# EAGLE design Wifi Schemati (EAGLE 9.2.2)
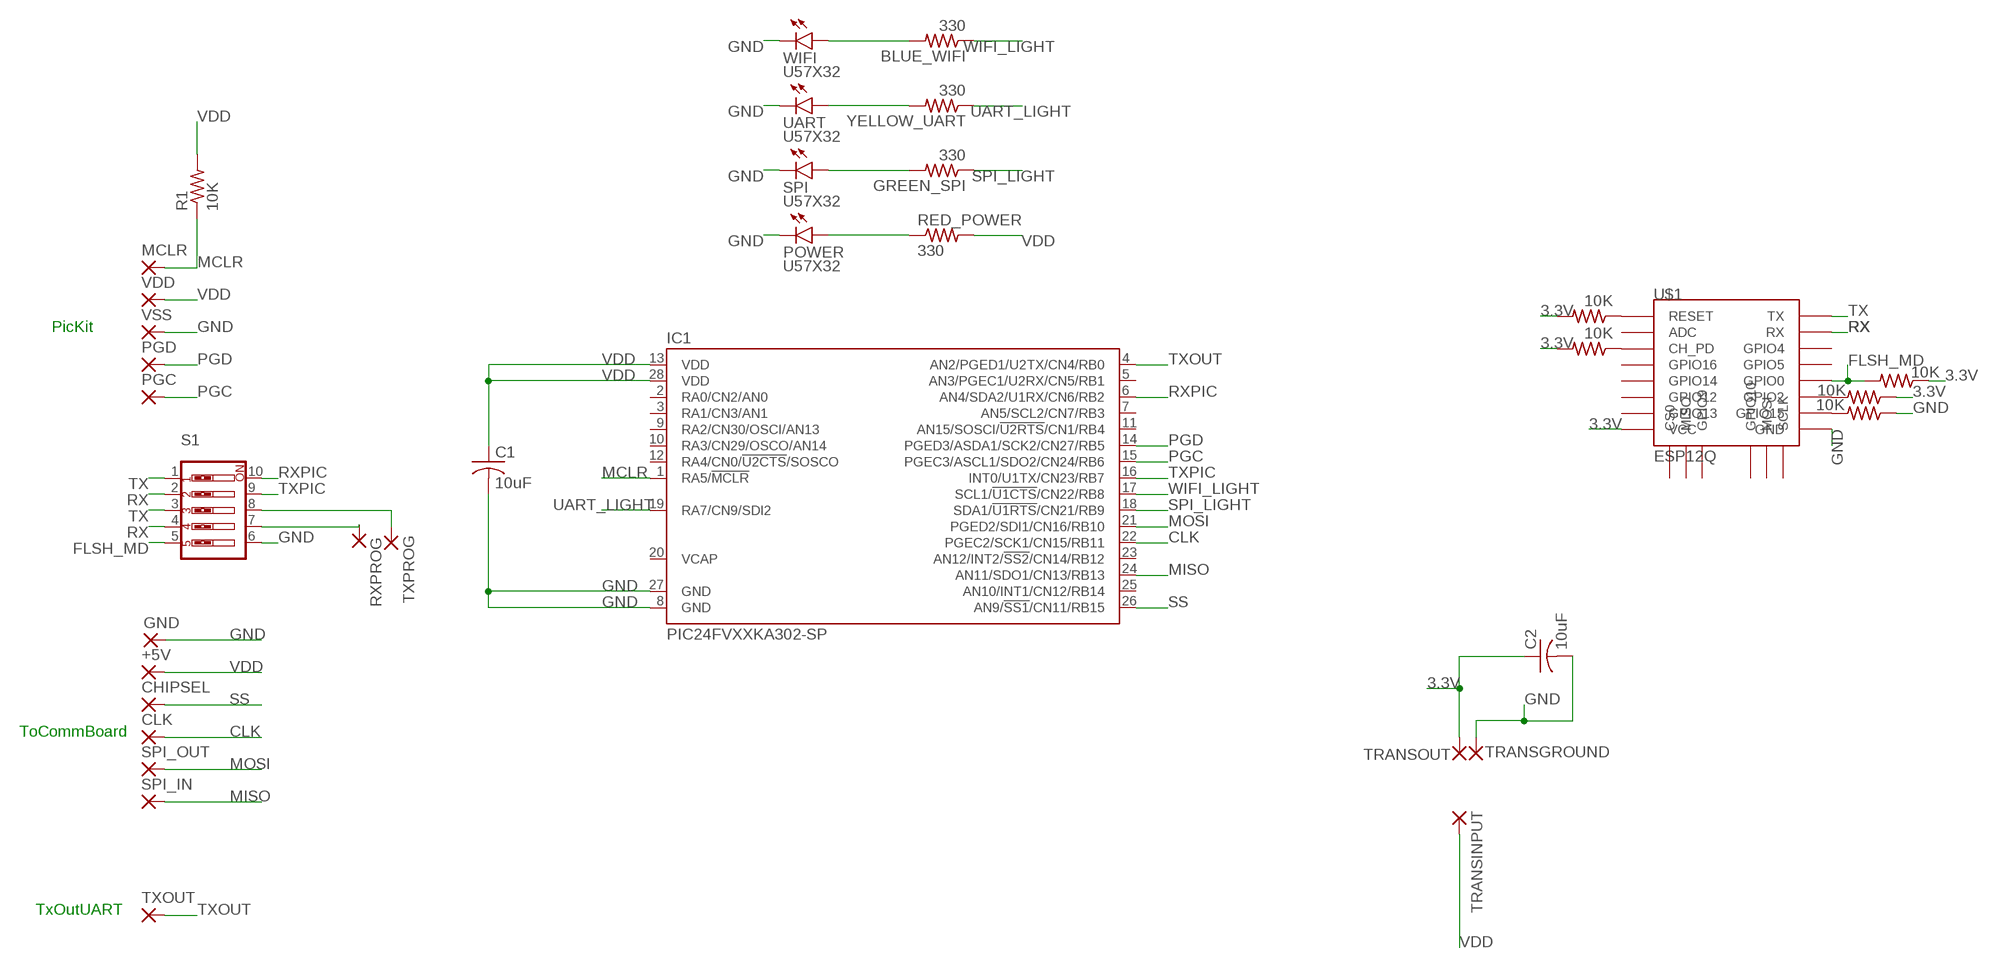
[diagram p0: schematic, sheet 1]

## Parts
+5V  1,6/0,8  [1,6/0,8]
BLUE_WIFI  330  R-US_0207/7  [0207/7]
C1  10uF  C-US025-025X050  [C025-025X050]
C2  10uF  C-US025-025X050  [C025-025X050]
CHIPSEL  1,6/0,8  [1,6/0,8]
CLK  1,6/0,8  [1,6/0,8]
GND  1,6/0,8  [1,6/0,8]
GREEN_SPI  330  R-US_0207/7  [0207/7]
IC1  PIC24FVXXKA302-SP  [DIL28-3]
MCLR  1,6/0,8  [1,6/0,8]
PGC  1,6/0,8  [1,6/0,8]
PGD  1,6/0,8  [1,6/0,8]
POWER  U57X32  [U57X32]
R1  10K  R-US_0207/7  [0207/7]
R2  10K  R-US_0207/7  [0207/7]
R3  10K  R-US_0207/7  [0207/7]
R4  10K  R-US_0207/7  [0207/7]
R5  10K  R-US_0207/7  [0207/7]
R6  10K  R-US_0207/7  [0207/7]
RED_POWER  330  R-US_0207/7  [0207/7]
RXPROG  1,6/0,8  [1,6/0,8]
S1  SW_DIP-5  [EDG-05]
SPI  U57X32  [U57X32]
SPI_IN  1,6/0,8  [1,6/0,8]
SPI_OUT  1,6/0,8  [1,6/0,8]
TRANSGROUND  1,6/0,8  [1,6/0,8]
TRANSINPUT  1,6/0,8  [1,6/0,8]
TRANSOUT  1,6/0,8  [1,6/0,8]
TXOUT  1,6/0,8  [1,6/0,8]
TXPROG  1,6/0,8  [1,6/0,8]
U$1  ESP12Q  [ESP12Q]
UART  U57X32  [U57X32]
VDD  1,6/0,8  [1,6/0,8]
VSS  1,6/0,8  [1,6/0,8]
WIFI  U57X32  [U57X32]
YELLOW_UART  330  R-US_0207/7  [0207/7]

## Nets
3.3V: C2.1 R3.1 R4.1 R5.2 R6.2 TRANSOUT.1(P) U$1.VCC
CLK: CLK.1(P) IC1.22(PGEC2/SCK1/CN15/RB11)
FLSH_MD: R4.2 S1.5 U$1.GPIO0
GND: C1.2 C2.2 GND.1(P) IC1.8(GND) IC1.27(GND) POWER.K(C) R2.1 S1.6 SPI.K(C) TRANSGROUND.1(P) U$1.GND UART.K(C) VSS.1(P) WIFI.K(C)
MCLR: IC1.1(RA5/!MCLR) MCLR.1(P) R1.1
MISO: IC1.24(AN11/SDO1/CN13/RB13) SPI_IN.1(P)
MOSI: IC1.21(PGED2/SDI1/CN16/RB10) SPI_OUT.1(P)
N$1: R5.1 U$1.RESET
N$2: R2.2 U$1.GPIO15
N$3: R3.2 U$1.GPIO2
N$4: S1.8 TXPROG.1(P)
N$5: RXPROG.1(P) S1.7
N$6: R6.1 U$1.CH_PD
N$7: POWER.A RED_POWER.1
N$8: GREEN_SPI.2 SPI.A
N$10: UART.A YELLOW_UART.2
N$11: BLUE_WIFI.2 WIFI.A
PGC: IC1.15(PGEC3/ASCL1/SDO2/CN24/RB6) PGC.1(P)
PGD: IC1.14(PGED3/ASDA1/SCK2/CN27/RB5) PGD.1(P)
RX: S1.2 S1.4 U$1.RX
RXPIC: IC1.6(AN4/SDA2/U1RX/CN6/RB2) S1.10
SPI_LIGHT: GREEN_SPI.1 IC1.18(SDA1/!U1RTS!/CN21/RB9)
SS: CHIPSEL.1(P) IC1.26(AN9/!SS1!/CN11/RB15)
TX: S1.1 S1.3 U$1.TX
TXOUT: IC1.4(AN2/PGED1/U2TX/CN4/RB0) TXOUT.1(P)
TXPIC: IC1.16(INT0/U1TX/CN23/RB7) S1.9
UART_LIGHT: IC1.19(RA7/CN9/SDI2) YELLOW_UART.1
VDD: +5V.1(P) C1.1 IC1.13(VDD) IC1.28(VDD) R1.2 RED_POWER.2 TRANSINPUT.1(P) VDD.1(P)
WIFI_LIGHT: BLUE_WIFI.1 IC1.17(SCL1/!U1CTS!/CN22/RB8)
Unconnected: IC1.2(RA0/CN2/AN0) IC1.3(RA1/CN3/AN1) IC1.5(AN3/PGEC1/U2RX/CN5/RB1) IC1.7(AN5/SCL2/CN7/RB3) IC1.9(RA2/CN30/OSCI/AN13) IC1.10(RA3/CN29/OSCO/AN14) IC1.11(AN15/SOSCI/!U2RTS!/CN1/RB4) IC1.12(RA4/CN0/!U2CTS!/SOSCO) IC1.20(VCAP) IC1.23(AN12/INT2/!SS2!/CN14/RB12) IC1.25(AN10/INT1/CN12/RB14) U$1.ADC U$1.CS0 U$1.GPIO4 U$1.GPIO5 U$1.GPIO9 U$1.GPIO10 U$1.GPIO12 U$1.GPIO13 U$1.GPIO14 U$1.GPIO16 U$1.MISO U$1.MOSI U$1.SCLK

## Notes on the sheet
- PicKit
- ToCommBoard
- TxOutUART

## Library data of the parts
+5V CHIPSEL CLK GND MCLR PGC PGD RXPROG SPI_IN SPI_OUT TRANSGROUND TRANSINPUT TRANSOUT TXOUT TXPROG VDD VSS = wirepad:1,6/0,8: THROUGH-HOLE PAD
BLUE_WIFI GREEN_SPI R1-R6 RED_POWER YELLOW_UART = rcl:R-US_: RESISTOR, American symbol; SPICEPREFIX: R
C1 C2 = rcl:C-US: CAPACITOR, American symbol; SPICEPREFIX: C
IC1 = pic24kakl:PIC24FVXXKA302: PIC24FVXXKA302 2.0-5.5V 28 pin
POWER SPI UART WIFI = led:U57X32: LED rectangle, 5.7 x 3.2 mm
S1 = special:SW_DIP-5: DIP SWITCH
U$1 = esp826612q:ESP12Q: ESP8266 Wifi module 12-Q; SPICEPREFIX: X

## Board
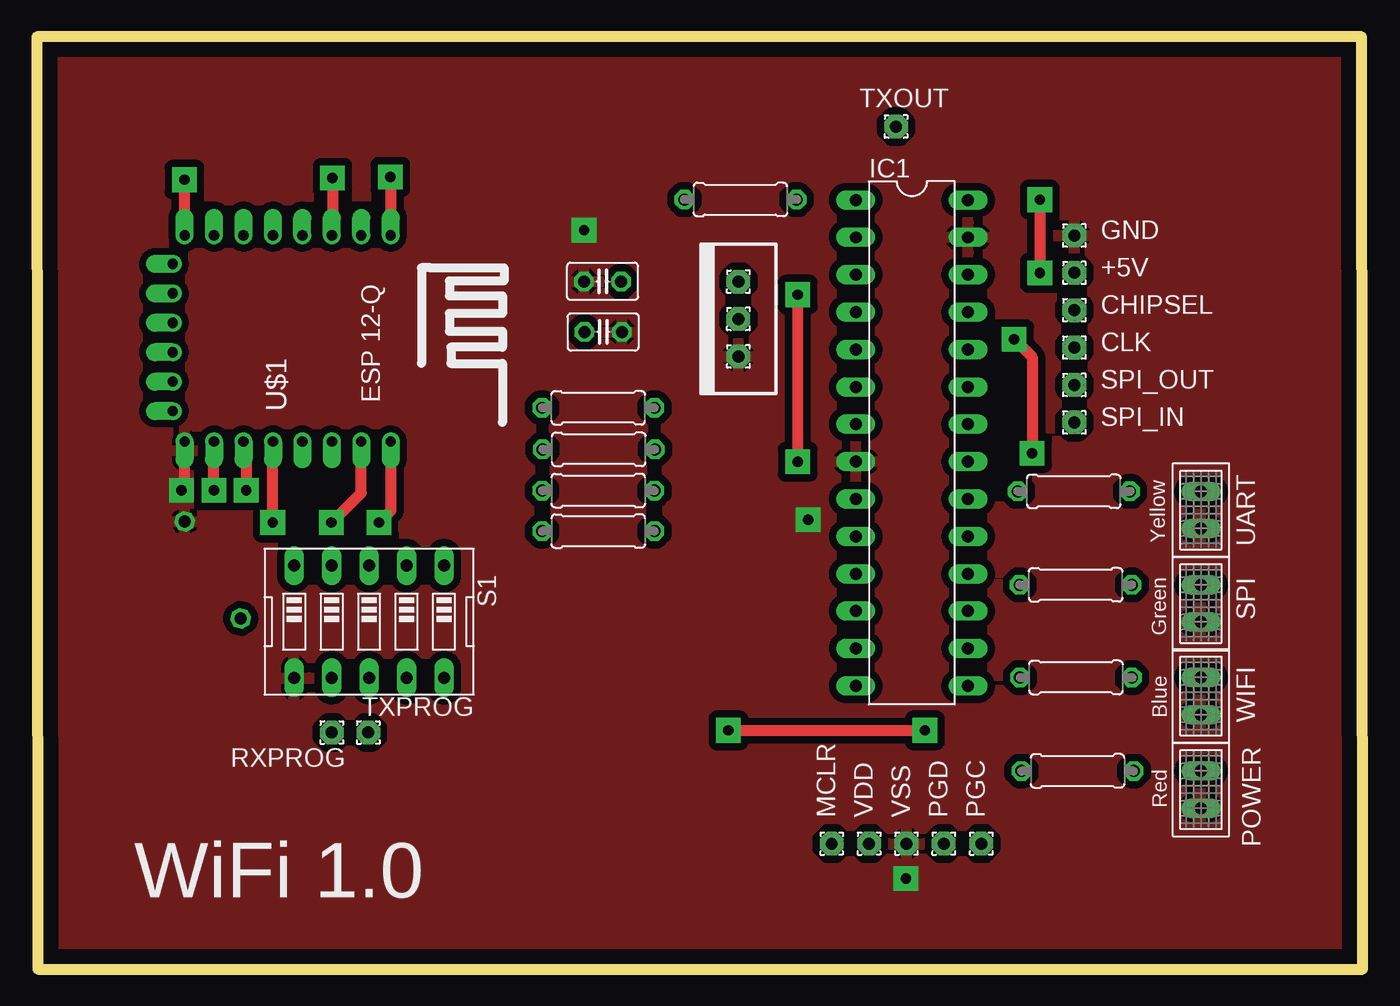
[diagram p1: board, top side]
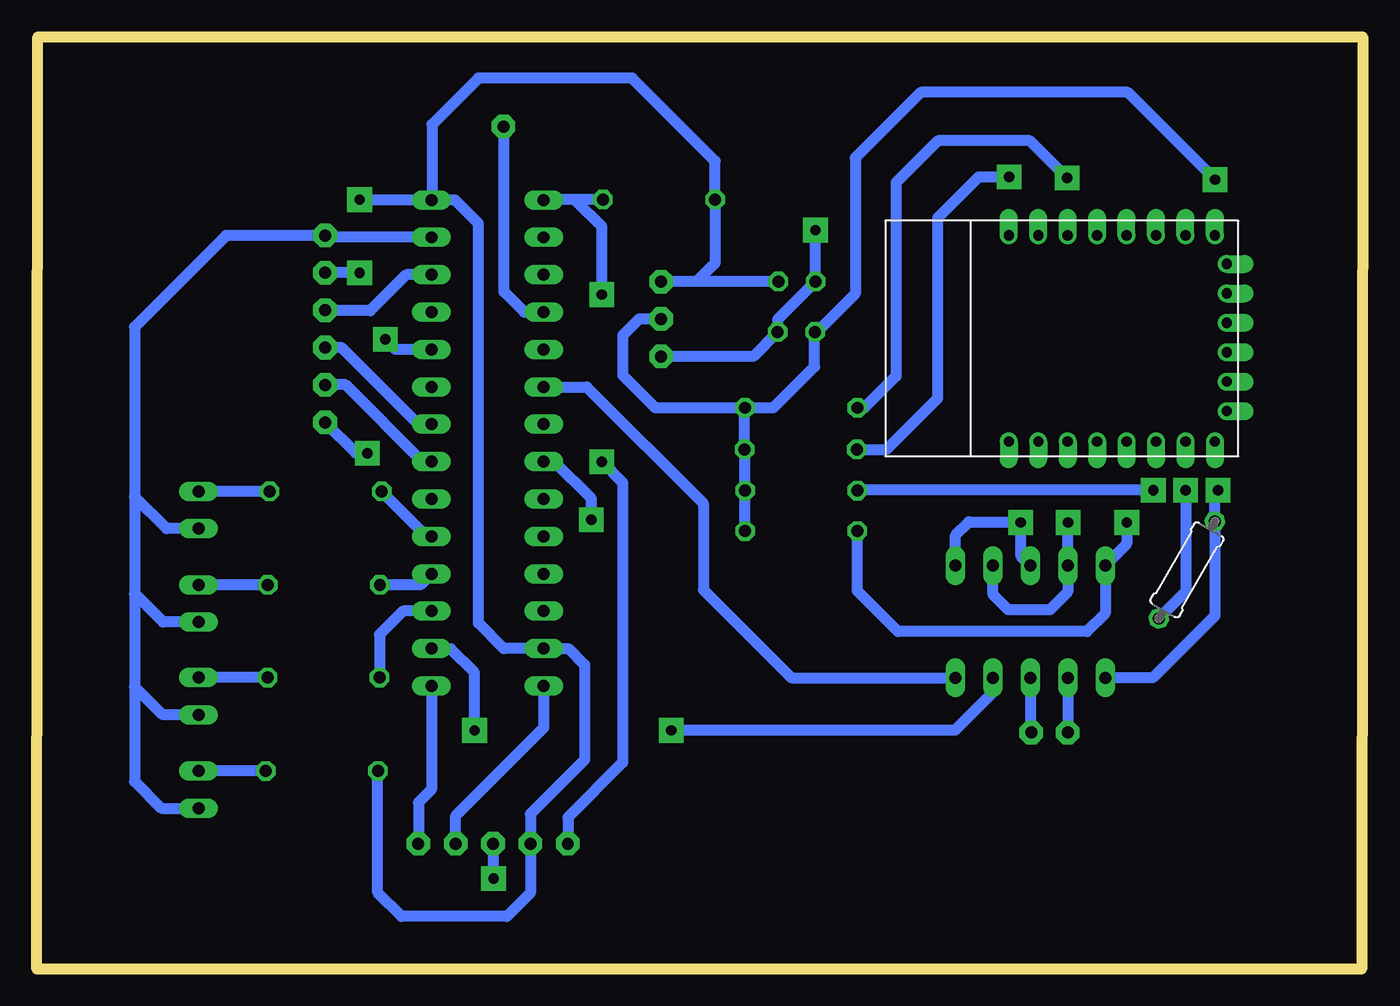
[diagram p2: board, bottom side, seen from below]

Size 90.1 x 63.36 mm. Coordinates in mm from the lower left corner, seen from the top.
Outline: 0.06,0 90.1,0 90.03,63.36 0,63.36 0.06,0
Copper layers (1*16): Top 0.035mm / dielectric 1.5mm / Bottom 0.035mm
Design rules "default *": minimum track width 10mil, minimum drill 22mm, track to track 20mil, track to pad 20mil, pad to pad 20mil, via to via 20mil, smd to smd 8mil, copper to edge 40mil, drill to drill 8mil, minimum pad ring 10mil, minimum via ring 8mil, stop-mask expansion 4mil, vias tented up to drill 0mil, thermal gap 10mil

### Footprints (pad centres in the part's own frame; a part is rotated, then mirrored left to right if it is on the bottom)
1,6/0,8 = drill 0.813 pad 1.6 octagon: 1 0,0
0207/7 = drill 0.813 octagon: 1 -3.81,0; 2 3.81,0
C025-025X050 = drill 0.813 octagon: 1 -1.27,0; 2 1.27,0
DIL28-3 = drill 0.813 long: 1 -16.51,-3.81; 2 -13.97,-3.81; 3 -11.43,-3.81; 4 -8.89,-3.81; 5 -6.35,-3.81; 6 -3.81,-3.81; 7 -1.27,-3.81; 8 1.27,-3.81; 9 3.81,-3.81; 10 6.35,-3.81; 11 8.89,-3.81; 12 11.43,-3.81; 13 13.97,-3.81; 14 16.51,-3.81; 15 16.51,3.81; 16 13.97,3.81; 17 11.43,3.81; 18 8.89,3.81; 19 6.35,3.81; 20 3.81,3.81; 21 1.27,3.81; 22 -1.27,3.81; 23 -3.81,3.81; 24 -6.35,3.81; 25 -8.89,3.81; 26 -11.43,3.81; 27 -13.97,3.81; 28 -16.51,3.81
U57X32 = drill 0.813 long: A -1.27,0; K 1.27,0
EDG-05 = drill 0.813 long: 1 -5.08,-3.81; 2 -2.54,-3.81; 3 0,-3.81; 4 2.54,-3.81; 5 5.08,-3.81; 6 5.08,3.81; 7 2.54,3.81; 8 0,3.81; 9 -2.54,3.81; 10 -5.08,3.81
ESP12Q = drill 0.7 offset: ADC -7.1,3.8; CH_PD -7.1,1.8; CS0 -5.165,-9.005; GND 6.9,-8.2; GPIO0 6.9,-2.2; GPIO2 6.9,-4.2; GPIO4 6.9,1.8; GPIO5 6.9,-0.2; GPIO9 -1.165,-9.005; GPIO10 0.835,-9.005; GPIO12 -7.1,-4.2; GPIO13 -7.1,-6.2; GPIO14 -7.1,-2.2; GPIO15 6.9,-6.2; GPIO16 -7.1,-0.2; MISO -3.165,-9.005; MOSI 2.835,-9.005; RESET -7.1,5.8; RX 6.9,3.8; SCLK 4.835,-9.005; TX 6.9,5.8; VCC -7.1,-8.2

### Placement (x,y rotation side)
+5V  70.5,47.32 0 top
BLUE_WIFI  70.61,19.82 0 top
C1  38.44,46.74 180 top
C2  38.48,43.3 0 top
CHIPSEL  70.5,44.78 0 top
CLK  70.5,42.24 0 top
GND  70.5,49.86 0 top
GREEN_SPI  70.6,26.12 0 top
IC1  59.46,35.76 270 top
MCLR  54.01,8.53 90 top
PGC  64.17,8.53 90 top
PGD  61.63,8.53 90 top
POWER  79.1,12.2 270 top
R1  47.81,52.3 180 top
R2  11.95,27.13 240 bottom
R3  38.15,32.52 180 top
R4  38.15,29.76 180 top
R5  38.19,35.33 0 top
R6  38.15,38.15 0 top
RED_POWER  70.72,13.47 180 top
RXPROG  20.05,16.07 90 top
S1  22.58,23.61 180 top
SPI  79.1,24.85 270 top
SPI_IN  70.5,37.16 0 top
SPI_OUT  70.5,39.7 0 top
TRANSGROUND  47.67,41.64 0 top
TRANSINPUT  47.67,46.72 0 top
TRANSOUT  47.67,44.18 0 top
TXOUT  58.38,57.26 0 top
TXPROG  22.52,16.07 90 top
U$1  18.24,42.76 270 top
UART  79.1,31.2 270 top
VDD  56.55,8.53 90 top
VSS  59.09,8.53 90 top
WIFI  79.1,18.55 270 top
YELLOW_UART  70.47,32.47 0 top

### Tracks (layer width: path | path; a pad name or v marks a point on that pad's centre or on a via)
3.3V  (via drill 0.7 pad 1.68)
  Top 0.762: v10.03,53.64 10.03,49.88 U$1.VCC
  Bottom 0.762: R4.1 R3.1 41.96,35.29 R5.2 42,38.11 R6.2 | R6.2 40.04,38.15 37.25,40.94 37.25,43.26 | 37.25,43.26 C2.1 | R6.2 48.08,38.15 50.29,40.35 50.29,43.06 49.17,44.18 TRANSOUT.1 | v10.03,53.64 15.96,59.58 30.03,59.58 34.48,55.13 34.48,45.9 37.12,43.26 37.25,43.26
CLK
  Bottom 0.762: IC1.22 64.19,37.03 69.38,42.23 70.49,42.23 CLK.1
FLSH_MD  (via drill 0.7 pad 1.68)
  Top 0.762: v16.03,30.35 16.03,35.84 U$1.GPIO0
  Bottom 0.762: R4.2 34.35,25.71 31.58,22.94 18.74,22.94 17.5,24.17 S1.5 16.03,28.89 v16.03,30.35
GND  (via drill 0.7 pad 1.68)
  Top 0.762: v9.83,32.55 10.04,32.76 U$1.GND
  Bottom 0.762: TRANSGROUND.1 41.41,41.64 C2.2 39.75,44.16 C1.2 37.17,50.21 v37.19,50.23 | POWER.K 81.63,10.93 83.45,12.74 83.45,19.19 | 83.45,32.1 83.45,43.64 77.23,49.86 GND.1 70.37,49.73 IC1.27 | 83.45,32.1 83.45,25.52 | 83.45,25.52 83.45,19.19 | WIFI.K 81.53,17.28 83.45,19.19 | SPI.K 81.51,23.58 83.45,25.52 | UART.K 81.28,29.93 83.45,32.1 | VSS.1 59.09,6.2 v59.06,6.16 | S1.6 14.26,19.8 10.04,24.02 R2.1 10.04,32.34 v9.83,32.55 | v52.41,30.55 52.41,31.97 54.94,34.49 IC1.8
  pour Top: 0.09,63.19 89.9,63.19 89.9,0.1 0.09,0.1
MCLR  (via drill 0.7 pad 1.68)
  Top 0.762: v51.7,45.84 v51.7,34.48
  Bottom 0.762: MCLR.1 54.01,10.3 50.29,14.03 50.29,33.06 v51.7,34.48 | v51.7,45.84 51.7,50.46 53.45,52.2 53.45,52.3 | R1.1 53.45,52.3 | 53.45,52.3 55.65,52.3 IC1.1
MISO  (via drill 0.7 pad 1.68)
  Top 0.762: v67.64,35.06 67.64,41.58 v66.41,42.81
  Bottom 0.762: v67.64,35.06 68.41,35.06 SPI_IN.1 | IC1.24 65.72,42.11 v66.41,42.81
MOSI
  Bottom 0.762: IC1.21 63.9,34.49 69.12,39.71 70.49,39.71 SPI_OUT.1
N$1  (via drill 0.7 pad 1.68)
  Top 0.762: v24.03,53.84 24.03,49.88 U$1.RESET
  Bottom 0.762: R5.1 32.35,35.33 28.87,38.81 28.87,51.06 26.09,53.84 v24.03,53.84
N$2  (via drill 0.7 pad 1.68)
  Top 0.762: v12.03,32.55 12.03,35.84 U$1.GPIO15
  Bottom 0.762: v12.03,32.55 12.03,25.66 R2.2
N$3  (via drill 0.7 pad 1.68)
  Top 0.762: U$1.GPIO2 14.22,35.68 v14.22,32.55
  Bottom 0.762: R3.2 34.31,32.55 v14.22,32.55
N$4
  Bottom 0.762: S1.8 22.58,16.13 TXPROG.1
N$5
  Bottom 0.762: S1.7 RXPROG.1
N$6  (via drill 0.7 pad 1.68)
  Top 0.762: v20.09,53.77 20.09,49.91 U$1.CH_PD
  Bottom 0.762: v20.09,53.77 22.61,56.29 28.87,56.29 31.7,53.45 31.7,40.29 33.85,38.15 R6.1
N$7
  Bottom 0.762: RED_POWER.1 POWER.A
N$8
  Bottom 0.762: GREEN_SPI.2 SPI.A
N$10
  Bottom 0.762: YELLOW_UART.2 UART.A
N$11
  Bottom 0.762: BLUE_WIFI.2 WIFI.A
PGC
  Bottom 0.762: IC1.15 63.27,12.2 64.16,11.32 64.16,8.55 PGC.1
PGD
  Bottom 0.762: PGD.1 61.63,10.42 55.64,16.42 55.64,19.23 IC1.14
RX  (via drill 0.7 pad 1.68)
  Top 0.762: v20.03,30.35 22.04,32.37 U$1.RX
  Bottom 0.762: v20.03,30.35 20.04,30.34 S1.4 20.04,25.63 21.25,24.42 24.09,24.42 25.12,25.45 S1.2
RXPIC
  Bottom 0.762: IC1.6 52.73,39.57 44.8,31.64 44.8,25.77 38.82,19.8 S1.10
SPI_LIGHT
  Bottom 0.762: IC1.18 64.02,26.12 GREEN_SPI.1
SS
  Bottom 0.762: IC1.26 65,47.19 67.45,44.74 70.47,44.74 CHIPSEL.1
TX  (via drill 0.7 pad 1.68)
  Top 0.762: U$1.TX 24.04,31.15 v23.25,30.35
  Bottom 0.762: 23.22,30.39 v23.25,30.35 | S1.1 27.66,29.49 26.76,30.39 23.22,30.39 | S1.3 23.22,28.05 23.22,30.39
TXOUT
  Bottom 0.762: IC1.4 56.97,44.65 58.35,46.03 58.35,57.23 TXOUT.1
TXPIC  (via drill 0.7 pad 1.68)
  Top 0.762: v47,16.23 v60.35,16.23
  Bottom 0.762: S1.9 25.12,18.81 27.7,16.23 v47,16.23 | IC1.16 63.26,21.77 61.96,21.77 60.35,20.16 v60.35,16.23
UART_LIGHT
  Bottom 0.762: IC1.19 63.6,29.41 YELLOW_UART.1
VDD  (via drill 0.7 pad 1.68)
  Top 0.762: v68.16,52.29 v68.16,47.32 | v68.16,47.32
  Bottom 0.762: C1.1 45.25,46.74 | 45.25,46.74 47.66,46.74 TRANSINPUT.1 | 45.25,46.74 44,47.99 R1.2 44,54.91 49.64,60.55 60.09,60.55 63.25,57.39 63.25,52.29 IC1.28 | RED_POWER.2 66.93,13.45 66.93,5.19 65.32,3.58 58.16,3.58 56.55,5.18 VDD.1 56.55,10.54 52.87,14.23 52.87,20.68 53.98,21.79 IC1.13 58.36,21.79 60.09,23.52 60.09,50.68 61.7,52.29 61.73,52.27 IC1.28 | IC1.28 68.13,52.27 v68.16,52.29 | v68.16,47.32 +5V.1
WIFI_LIGHT
  Bottom 0.762: IC1.17 65.21,24.33 66.8,22.74 BLUE_WIFI.1

### Text on the board
tNames: Yellow | Green | Blue | Red | WiFi 1.0